# EAGLE design SchematicTest (EAGLE 9.6.2)
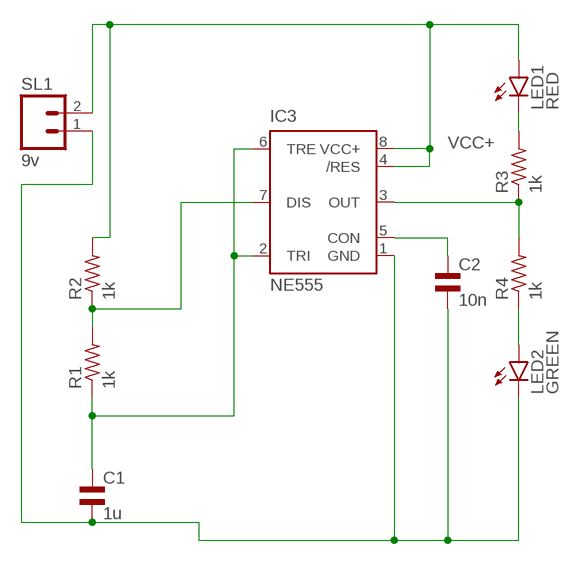
[diagram p0: schematic, sheet 1]

## Parts
C1  1u  EL-BI25-10AXIAL  [EU25-10]
C2  10n  EL-BI25-10AXIAL  [EU25-10]
IC3  NE555  [DIL-08]
LED1  RED  LED5MM  [LED5MM]
LED2  GREEN  LED5MM  [LED5MM]
R1  1k  R-US_0204/2V  [0204V]
R2  1k  R-US_0204/2V  [0204V]
R3  1k  R-US_0204/2V  [0204V]
R4  1k  R-US_0204/2V  [0204V]
SL1  9v  M02  [02P]

## Nets
GND: C1.2 C2.2 IC3.1(GND) LED2.K(C) SL1.1
N$1: IC3.3(OUT) R3.1 R4.2
N$3: LED2.A R4.1
N$4: LED1.K(C) R3.2
N$6: IC3.7(DIS) R1.2 R2.1
N$7: C1.1 IC3.2(TRI) IC3.6(TRE) R1.1
N$8: C2.1 IC3.5(CON)
VCC+: IC3.4(/RES) IC3.8(VCC+) LED1.A R2.2 SL1.2

## Library data of the parts
C1 C2 = rcl:EL-: BIPOLAR ELECTROLYTIC CAPACITOR; SPICEPREFIX: C
IC3 = st-microelectronics:NE555: General purpose bipolar Timer; MF: Arrow Electronics; MPN: NE555N; OC_FARNELL: 1467742; OC_NEWARK: 89K1486
LED1 LED2 = led:LED: LED OSRAM: - CHIPLED LG R971, LG N971, LY N971, LG Q971, LY Q971, LO R971, LY R971 LH N974, LH R974 LS Q976, LO Q976, LY Q976 LO Q996 - Hyper CHIPLED LW Q18S LB Q993, LB Q99A, LB R99A - SideLED LS A670, LO A670, LY A670, LG A670, LP A670 LB A673, LV A673, LT A673, LW A673 LH A674 LY A675 LS A676, LA A676, LO A676, LY A676, LW A676 LS A679, LY A679, LG A679 - Hyper Micro SIDELED® LS Y876, LA Y876, LO Y876, LY Y876 LT Y87S - SmartLED LW L88C, LW L88S LB L89C, LB L89S, LG L890 LS L89K, LO L89K, LY L89K LS L896, LA L896, LO L896, LY L896 - TOPLED LS T670, LO T670, LY T670, LG T670, LP T670 LSG T670, LSP T670, LSY T670, LOP T670, LYG T670 LG T671, LOG T671, LSG T671 LB T673, LV T673, LT T673, LW T673 LH T674 LS T676, LA T676, LO T676, LY T676, LB T676, LH T676, LSB T676, LW T676 LB T67C, LV T67C, LT T67C, LS T67K, LO T67K, LY T67K, LW E67C LS E67B, LA E67B, LO E67B, LY E67B, LB E67C, LV E67C, LT E67C LW T67C LS T679, LY T679, LG T679 LS T770, LO T770, LY T770, LG T770, LP T770 LB T773, LV T773, LT T773, LW T773 LH T774 LS E675, LA E675, LY E675, LS T675 LS T776, LA T776, LO T776, LY T776, LB T776 LHGB T686 LT T68C, LB T68C - Hyper Mini TOPLED® LB M676 - Mini TOPLED Santana® LG M470 LS M47K, LO M47K, LY M47K Source: http://www.osram.convergy.de LUXEON: - LUMILED® LXK2-PW12-R00, LXK2-PW12-S00, LXK2-PW14-U00, LXK2-PW14-V00 LXK2-PM12-R00, LXK2-PM12-S00, LXK2-PM14-U00 LXK2-PE12-Q00, LXK2-PE12-R00, LXK2-PE12-S00, LXK2-PE14-T00, LXK2-PE14-U00 LXK2-PB12-K00, LXK2-PB12-L00, LXK2-PB12-M00, LXK2-PB14-N00, LXK2-PB14-P00, LXK2-PB14-Q00 LXK2-PR12-L00, LXK2-PR12-M00, LXK2-PR14-Q00, LXK2-PR14-R00 LXK2-PD12-Q00, LXK2-PD12-R00, LXK2-PD12-S00 LXK2-PH12-R00, LXK2-PH12-S00 LXK2-PL12-P00, LXK2-PL12-Q00, LXK2-PL12-R00 Source: www.luxeon.com KINGBRIGHT: KA-3528ASYC Source: www.kingbright.com
R1-R4 = rcl:R-US_: RESISTOR, American symbol; SPICEPREFIX: R
SL1 = con-amp-quick:M02: AMP QUICK CONNECTOR; OC_FARNELL: unknown; OC_NEWARK: unknown

## Board
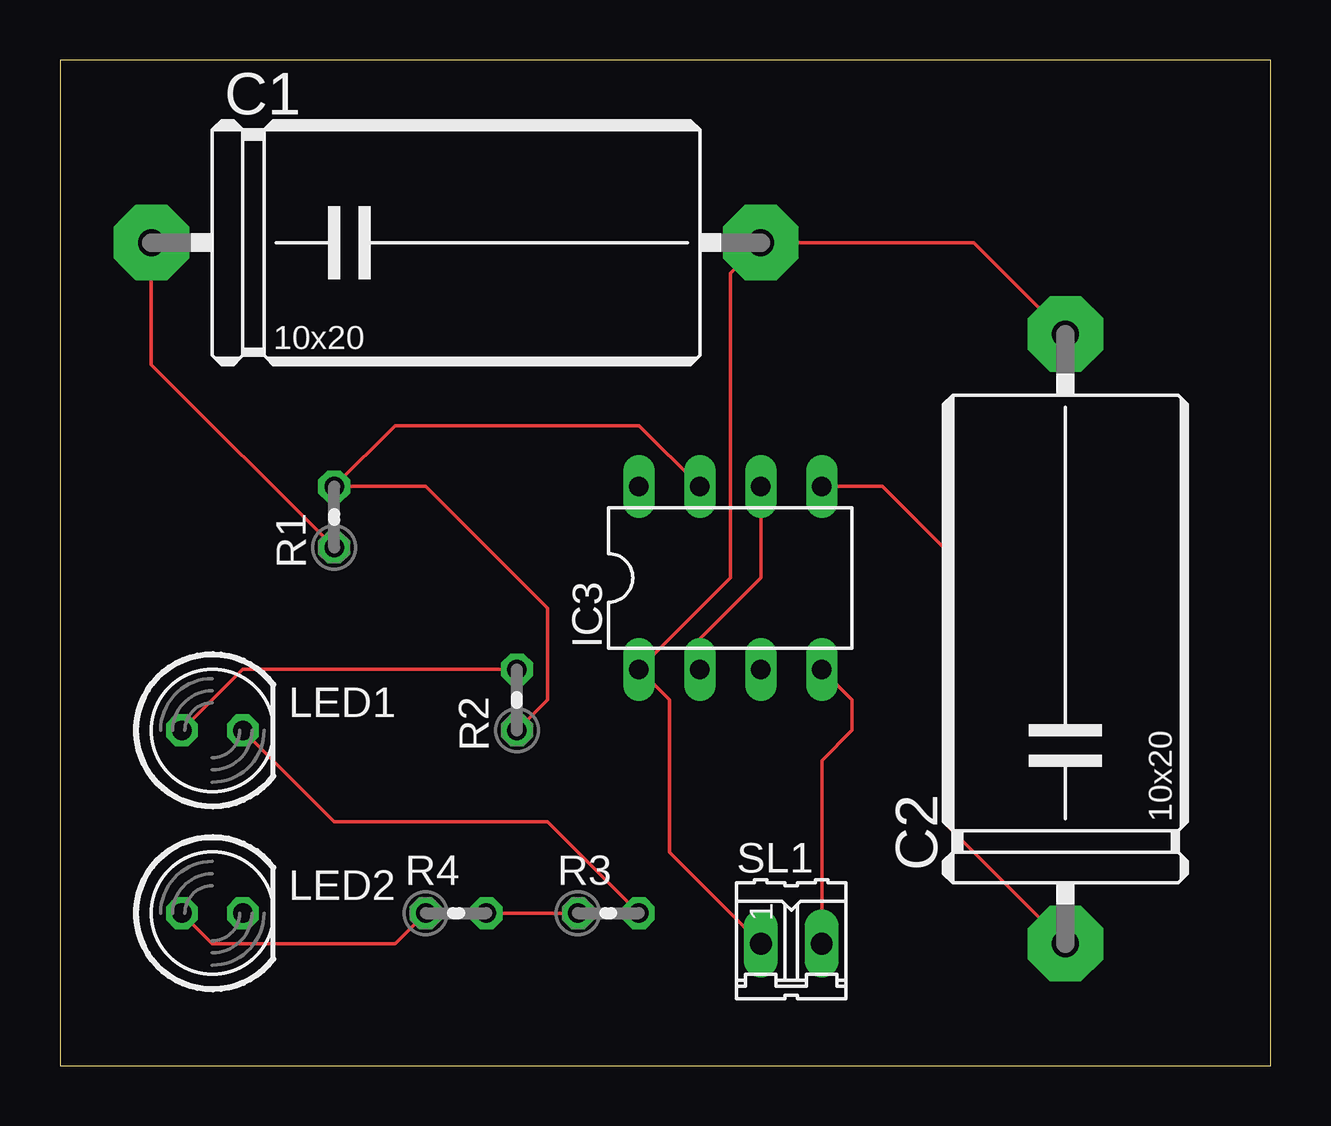
[diagram p1: board, top side]
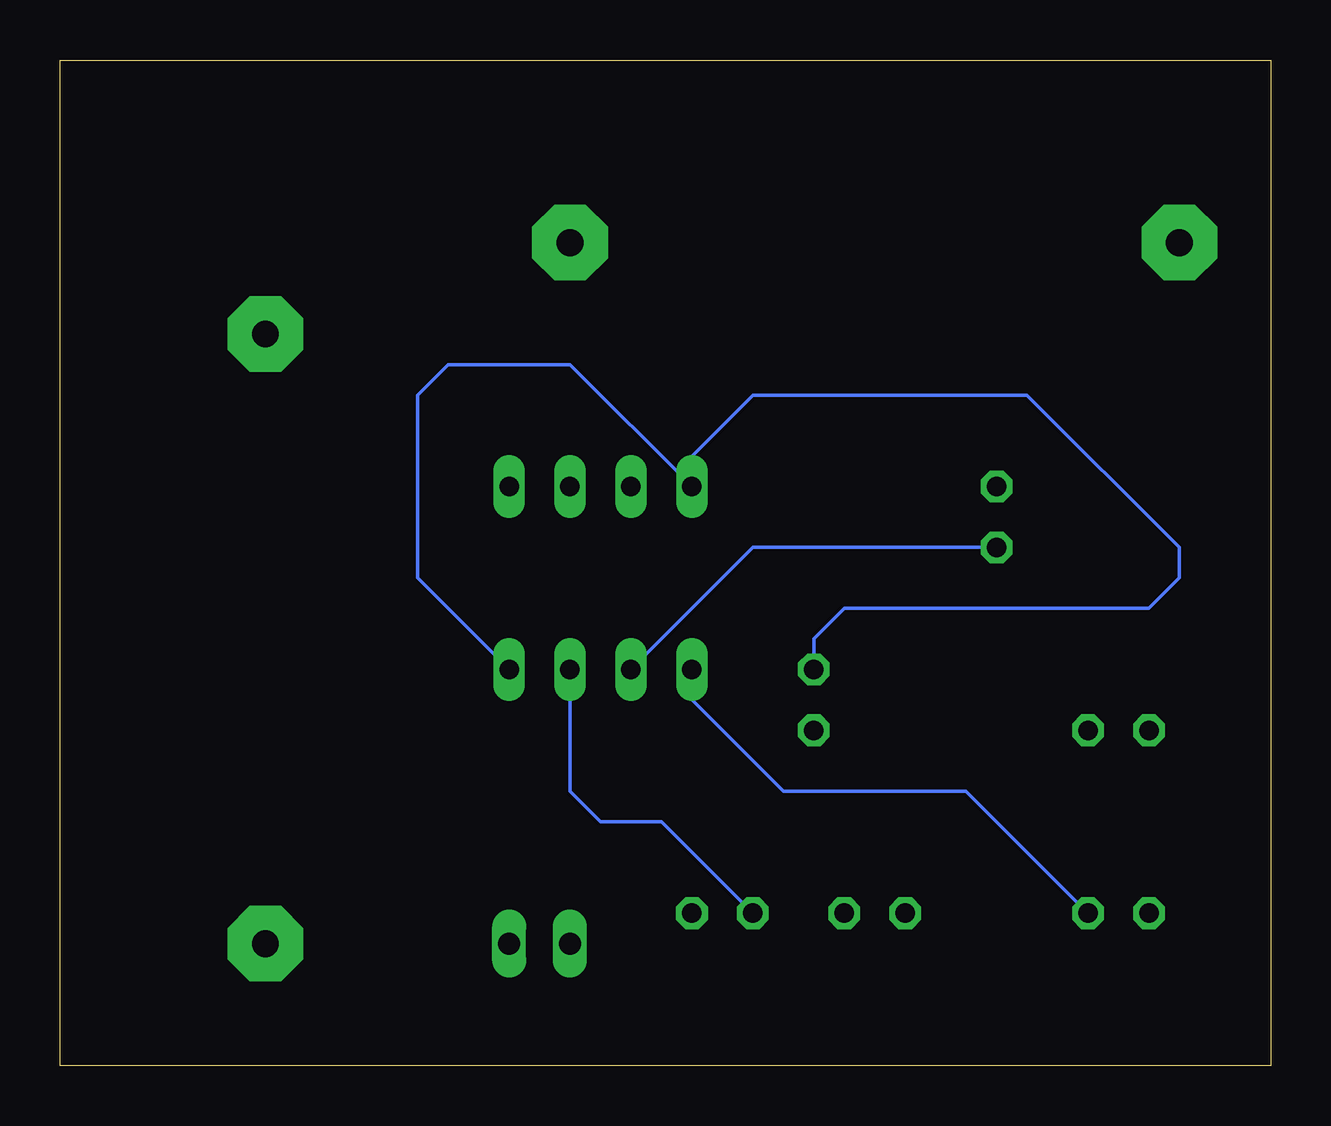
[diagram p2: board, bottom side, seen from below]

Size 50.47 x 41.9 mm. Coordinates in mm from the lower left corner, seen from the top.
Outline: 0,0 50.47,0 50.47,41.9 0,41.9 0,0
Copper layers (1*16): Top 0.035mm / dielectric 1.5mm / Bottom 0.035mm
Design rules "default": minimum track width 6mil, minimum drill 0.35mm, track to track 6mil, track to pad 6mil, pad to pad 6mil, via to via 6mil, smd to smd 6mil, copper to edge 40mil, drill to drill 6mil, minimum pad ring 10mil, minimum via ring 8mil, stop-mask expansion 4mil, vias tented up to drill 0mil, thermal gap 10mil

### Footprints (pad centres in the part's own frame; a part is rotated, then mirrored left to right if it is on the bottom)
EU25-10 = drill 1.118 pad 3.15 octagon: 1 -12.7,0; 2 12.7,0
DIL-08 = drill 0.813 long: 1 -3.81,-3.81; 2 -1.27,-3.81; 3 1.27,-3.81; 4 3.81,-3.81; 5 3.81,3.81; 6 1.27,3.81; 7 -1.27,3.81; 8 -3.81,3.81
LED5MM = drill 0.813 octagon: A -1.27,0; K 1.27,0
0204V = drill 0.813 octagon: 1 -1.27,0; 2 1.27,0
02P = drill 0.914 long: 1 -1.27,0; 2 1.27,0

### Placement (x,y rotation side)
C1  16.51,34.29 0 top
C2  41.91,17.78 90 top
IC3  27.94,20.32 0 top
LED1  6.35,13.97 0 top
LED2  6.35,6.35 0 top
R1  11.43,22.86 90 top
R2  19.05,15.24 90 top
R3  22.86,6.35 0 top
R4  16.51,6.35 0 top
SL1  30.48,5.08 0 top

### Tracks (layer width: path | path; a pad name or v marks a point on that pad's centre or on a via)
GND
  Top 0.152: C2.2 38.1,34.29 C1.2 27.94,33.02 27.94,20.32 IC3.1 25.4,15.24 25.4,8.89 SL1.1
  Bottom 0.152: LED2.K 12.7,11.43 20.32,11.43 24.13,15.24 IC3.1
N$1
  Top 0.152: R4.2 R3.1
  Bottom 0.152: R3.1 25.4,10.16 27.94,10.16 29.21,11.43 IC3.3
N$3
  Top 0.152: LED2.A 6.35,5.08 13.97,5.08 R4.1
N$4
  Top 0.152: R3.2 20.32,10.16 11.43,10.16 LED1.K
N$6
  Top 0.152: IC3.7 24.13,26.67 13.97,26.67 R1.2 15.24,24.13 20.32,19.05 20.32,15.24 R2.1
N$7
  Top 0.152: C1.1 3.81,29.21 R1.1 | IC3.2 26.67,17.78 29.21,20.32 IC3.6
  Bottom 0.152: IC3.2 21.59,21.59 R1.1
N$8
  Top 0.152: C2.1 36.83,10.16 36.83,21.59 34.29,24.13 IC3.5
VCC+
  Top 0.152: SL1.2 31.75,12.7 33.02,13.97 33.02,15.24 IC3.4 | LED1.A 7.62,16.51 R2.2
  Bottom 0.152: IC3.4 35.56,20.32 35.56,27.94 34.29,29.21 29.21,29.21 IC3.8 24.13,25.4 21.59,27.94 10.16,27.94 3.81,21.59 3.81,20.32 5.08,19.05 17.78,19.05 19.05,17.78 R2.2